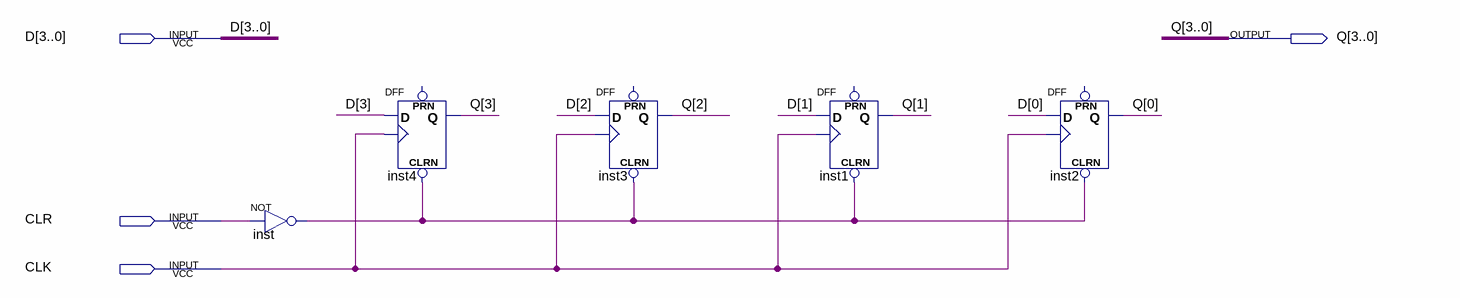
[diagram p0: schematic sheet]
// Quartus schematic CurrentState.bdf as structural Verilog: 5 symbols, 4 pins
module CurrentState (
  input  [3:0] D,
  input  CLR,
  input  CLK,
  output [3:0] Q
);

  wire inst_out;

  not inst (inst_out, CLR);
  DFF inst4 (.CLRN(inst_out), .CLK(CLK), .D(D[3]), .Q(Q[3]));  // open: PRN
  DFF inst3 (.CLRN(inst_out), .CLK(CLK), .D(D[2]), .Q(Q[2]));  // open: PRN
  DFF inst1 (.CLRN(inst_out), .CLK(CLK), .D(D[1]), .Q(Q[1]));  // open: PRN
  DFF inst2 (.CLRN(inst_out), .CLK(CLK), .D(D[0]), .Q(Q[0]));  // open: PRN
endmodule
